# Altium schematic sheet can_unisolated.SchDoc
size A4; Organization: UNSW Solar Racing Team; Address3: UNSW; Address4: Sydney NSW 2052; Address2: Electrical Engineering; Address1: Rm 109
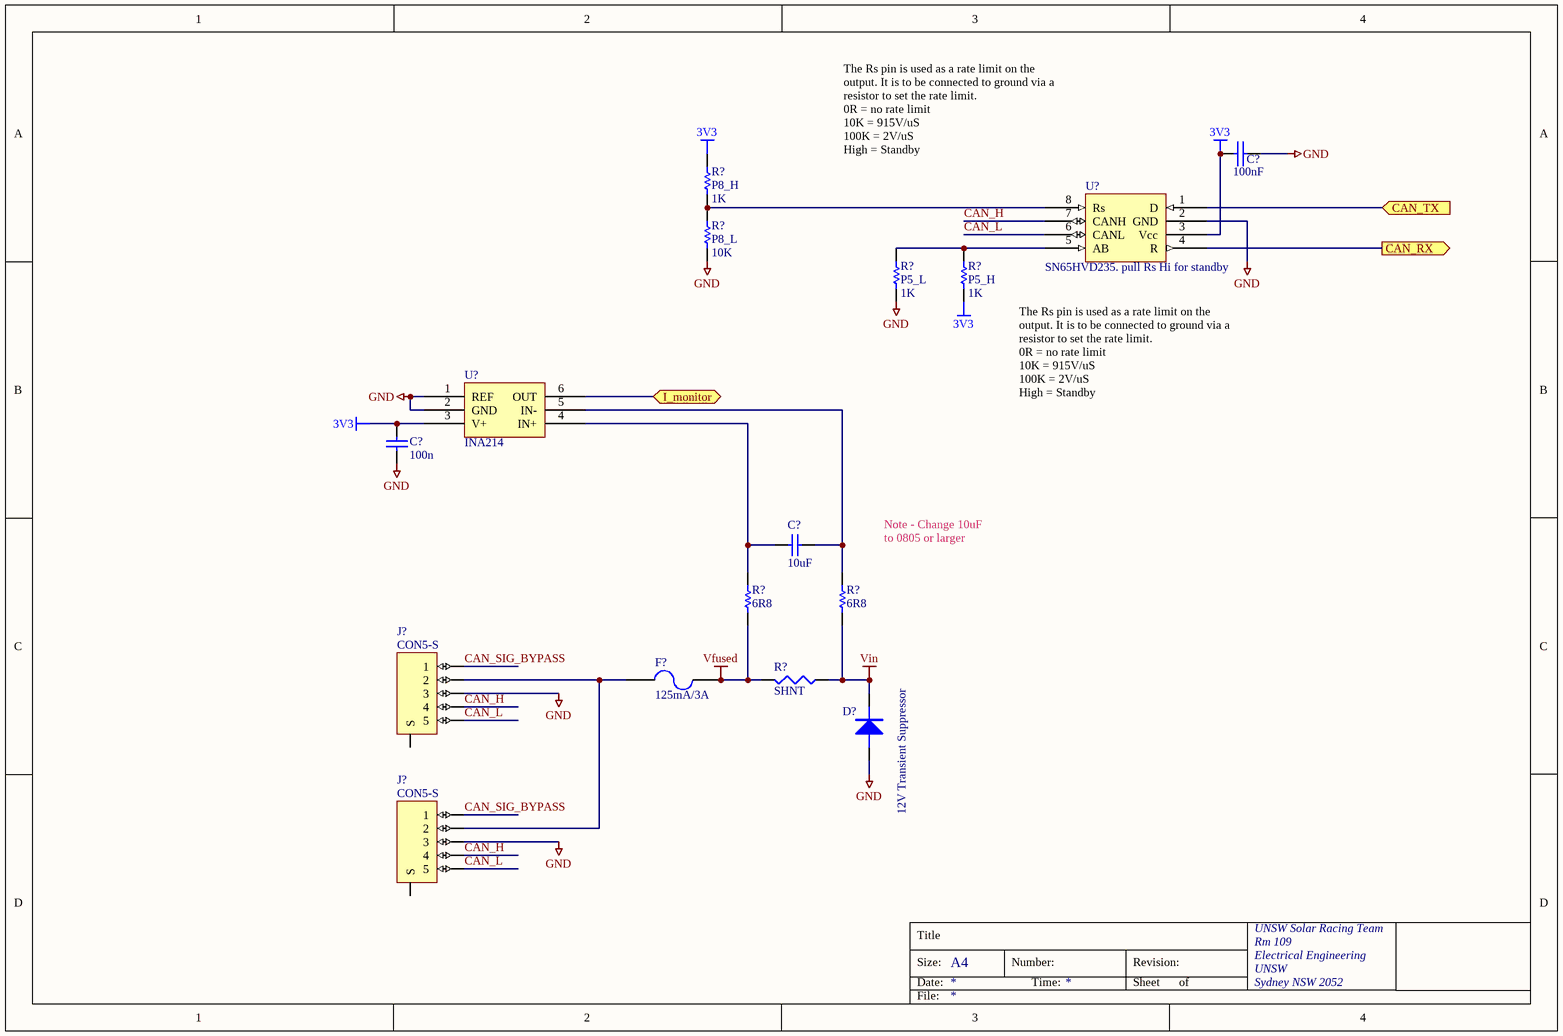
[diagram p0: can_unisolated.SchDoc]

## Parts
(Parts that share a designator on the sheet are numbered #1, #2 ... from top to bottom, then left to right.)
C?#1  100nF  [0603]
C?#2  100n  [0603]
C?#3  10uF  [0805]
D?  12V Transient Suppressor  [SMA]
F?  125mA/3A  [LITTELFUSE-154]
J?#1  CON5-S  [TRIAD5F]
J?#2  CON5-S  [TRIAD5F]
R?#1  P8_H  value 1K  [0603]
R?#2  P8_L  value 10K  [0603]
R?#3  P5_L  value 1K  [0603]
R?#4  P5_H  value 1K  [0603]
R?#5  6R8  [0603]
R?#6  6R8  [0603]
R?#7  SHNT  [0805]
U?#1  SN65HVD235. pull Rs Hi for standby  [SO8]
U?#2  INA214  [SC70-6]

## Ports
CAN_RX (out), CAN_TX (in), I_monitor

## Nets
3V3: C?#1.2 C?#2.2 R?#1.2 R?#4.1 U?#1.3(Vcc) U?#2.3(V+)
GND: C?#1.1 C?#2.1 D?.A J?#1.3 J?#2.3 R?#2.1 R?#3.1 U?#1.2(GND) U?#2.1(REF) U?#2.2(GND)
Vfused: F?.2 R?#5.2 R?#7.2
Vin: D?.K R?#6.2 R?#7.1
CAN_H: J?#1.4 J?#2.4 U?#1.7(CANH)
CAN_L: J?#1.5 J?#2.5 U?#1.6(CANL)
CAN_RX: U?#1.4(R) ; port CAN_RX
CAN_SIG_BYPASS: J?#1.1 J?#2.1
CAN_TX: U?#1.1(D) ; port CAN_TX
I_monitor: U?#2.6(OUT) ; port I_monitor
NetC?#3_1: C?#3.1 R?#5.1 U?#2.4(IN+)
NetC?#3_2: C?#3.2 R?#6.1 U?#2.5(IN-)
NetF?_1: F?.1 J?#1.2 J?#2.2
NetR?#1_1: R?#1.1 R?#2.2 U?#1.8(Rs)
NetR?#3_2: R?#3.2 R?#4.2 U?#1.5(AB)

Not connected (* = marked no-connect by the designer): J?#1 0(S); J?#2 0(S)

## Notes on the sheet
- (near U?#1) The Rs pin is used as a rate limit on the output. It is to be connected to ground via a resistor to set the rate limit.
  0R = no rate limit
  10K = 915V/uS
  100K = 2V/uS
  High = Standby
- The Rs pin is used as a rate limit on the output. It is to be connected to ground via a resistor to set the rate limit.
  0R = no rate limit
  10K = 915V/uS
  100K = 2V/uS
  High = Standby
- (near R?#6) Note - Change 10uF to 0805 or larger
- Title
- Size:
- Date:
- A4
- Number:
- Time:
- Revision:
- Sheet
- of
- File:

## Library data of the parts
C?#1 = CAP: Capacitor; Farnell: 753-567; Price: 0.31
C?#2 = Cap Semi: Capacitor (Semiconductor SIM Model); Value: 100nF; Published: 8-Jun-2000; LatestRevisionDate: 17-Jul-2002; LatestRevisionNote: Re-released for DXP Platform.; PackageReference: C1206; Publisher: Altium Limited; Element14: 9406140; Element14 Price: 0.13
C?#3 = Cap Semi: Capacitor (Semiconductor SIM Model); Value: 10uF; Element14: 1458902RL; Element14 Price: 0.69
D? = DIODE: Farnell: 302-3096; Price: 1.25
F? = FUSE2: Fuse; Farnell: 664-893; Other Info: www.littelfuse.com; Price: 5.67
J?#1 J?#2 = CON5-S: Connector, 2 pin, with shield @ S; Farnell: .131-040; Price: 19.32
R?#1-R?#6 = Res Semi: Semiconductor Resistor; Published: 8-Jun-2000; LatestRevisionDate: 17-Jul-2002; LatestRevisionNote: Re-released for DXP Platform.; PackageReference: AXIAL-0.5; Publisher: Altium Limited
  R?#1-R?#4: PackageDescription: Axial Device, Thru-Hole; 2 Leads; 0.5 in Pin Spacing
  R?#5 R?#6: Value: 6R8; Element14: 9331492RL; Element14 Price: 0.08 (min order 50)
R?#7 = Res3: Resistor; Publisher: Altium Limited; Element14: 8067520; Element14 Price: 0.62
U?#1 = SN65HVD235: 3.3V CAN XCVR W/STANDBY
U?#2 = INA214: Current Shunt Monitor; Element14: 1754262; Element14 Price: $4.22